# Altium schematic sheet M4_Sensors.SchDoc
size A3; SheetNumber: 4; SheetTotal: 5
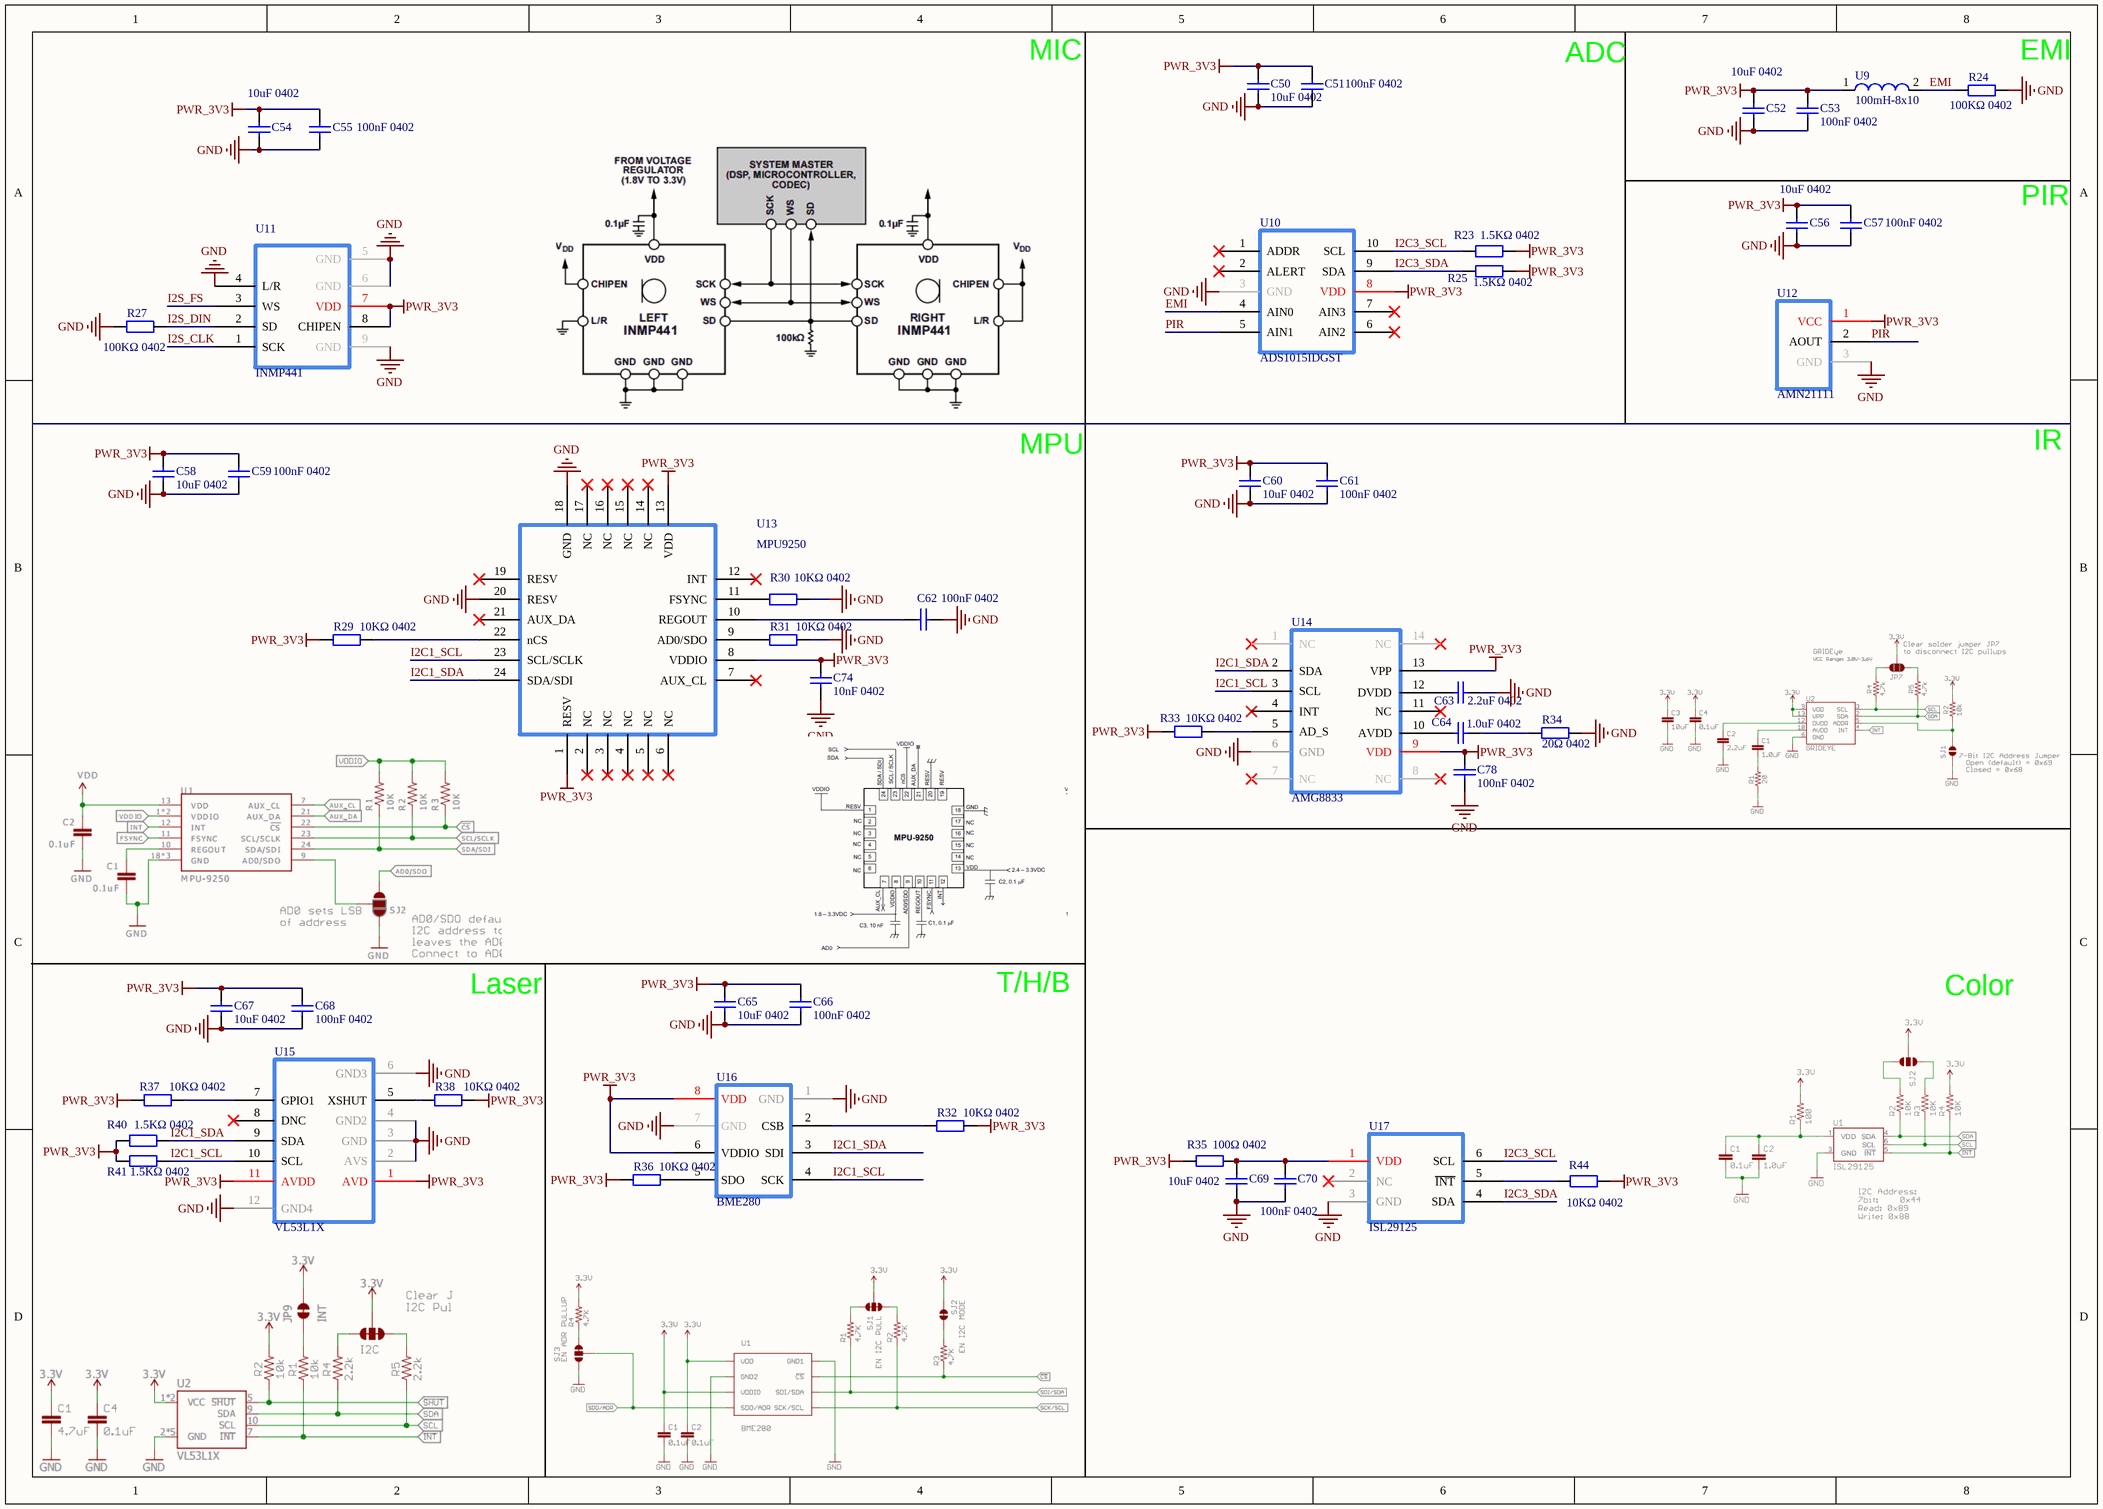
[diagram p0: M4_Sensors.SchDoc]

## Parts
C50  10uF 0402  [0402_C]
C51  100nF 0402  [0402_C]
C52  10uF 0402  [0402_C]
C53  100nF 0402  [0402_C]
C54  10uF 0402  [0402_C]
C55  100nF 0402  [0402_C]
C56  10uF 0402  [0402_C]
C57  100nF 0402  [0402_C]
C58  10uF 0402  [0402_C]
C59  100nF 0402  [0402_C]
C60  10uF 0402  [0402_C]
C61  100nF 0402  [0402_C]
C62  100nF 0402  [0402_C]
C63  2.2uF 0402  [0402_C]
C64  1.0uF 0402  [0402_C]
C65  10uF 0402  [0402_C]
C66  100nF 0402  [0402_C]
C67  10uF 0402  [0402_C]
C68  100nF 0402  [0402_C]
C69  10uF 0402  [0402_C]
C70  100nF 0402  [0402_C]
C74  10nF 0402  [0402_C]
C78  100nF 0402  [0402_C]
R23  1.5KΩ 0402  [0402_R]
R24  100KΩ 0402  [0402_R]
R25  1.5KΩ 0402  [0402_R]
R27  100KΩ 0402  [0402_R]
R29  10KΩ 0402  [0402_R]
R30  10KΩ 0402  [0402_R]
R31  10KΩ 0402  [0402_R]
R32  10KΩ 0402  [0402_R]
R33  10KΩ 0402  [0402_R]
R34  20Ω 0402  [0402_R]
R35  100Ω 0402  [0402_R]
R36  10KΩ 0402  [0402_R]
R37  10KΩ 0402  [0402_R]
R38  10KΩ 0402  [0402_R]
R40  1.5KΩ 0402  [0402_R]
R41  1.5KΩ 0402  [0402_R]
R44  10KΩ 0402  [0402_R]
U9  100mH-8x10  [100mH-8x10]
U10  ADS1015IDGST  [ADS1015]
U11  INMP441  [INMP441]
U12  AMN21111  [AMN21111]
U13  MPU9250  [MPU9250]
U14  AMG8833  [AMG8833]
U15  VL53L1X  [VL53L1X]
U16  BME280  [BME280]
U17  ISL29125  [ISL29125]

## Nets
GND: C50.1 C51.1 C52.1 C53.1 C54.1 C55.1 C56.1 C57.1 C58.2 C59.2 C60.2 C61.2 C62.2 C63.2 C65.2 C66.2 C67.1 C68.1 C69.2 C70.2 C74.1 C78.2 R24.2 R27.2 R30.2 R31.2 R34.2 U10.3(GND) U11.4(L/R) U11.5(GND) U11.6(GND) U11.9(GND) U12.3(GND) U13.18(GND) U13.20(RESV) U14.6(GND) U15.2(AVS) U15.3(GND) U15.4(GND2) U15.6(GND3) U15.12(GND4) U16.1(GND) U16.7(GND) U17.3(GND)
PWR_3V3: C50.2 C51.2 C52.2 C53.2 C54.2 C55.2 C56.2 C57.2 C58.1 C59.1 C60.1 C61.1 C65.1 C66.1 C67.2 C68.2 C74.2 C78.1 R23.2 R25.2 R29.1 R32.2 R33.1 R35.1 R36.1 R37.1 R38.2 R40.1 R41.1 R44.2 U9.1 U10.8(VDD) U11.7(VDD) U11.8(CHIPEN) U12.1(VCC) U13.1(RESV) U13.8(VDDIO) U13.13(VDD) U14.9(VDD) U14.13(VPP) U15.1(AVD) U15.11(AVDD) U16.6(VDDIO) U16.8(VDD)
EMI: R24.1 U9.2 U10.4(AIN0)
I2C1_SCL: R41.2 U13.23(SCL/SCLK) U14.3(SCL) U15.10(SCL) U16.4(SCK)
I2C1_SDA: R40.2 U13.24(SDA/SDI) U14.2(SDA) U15.9(SDA) U16.3(SDI)
I2C3_SCL: R23.1 U10.10(SCL) U17.6(SCL)
I2C3_SDA: R25.1 U10.9(SDA) U17.4(SDA)
I2S_CLK: U11.1(SCK)
I2S_DIN: R27.1 U11.2(SD)
I2S_FS: U11.3(WS)
PIR: U10.5(AIN1) U12.2(AOUT)
NetC62_1: C62.1 U13.10(REGOUT)
NetC63_1: C63.1 U14.12(DVDD)
NetC64_1: C64.1 U14.10(AVDD)
NetC64_2: C64.2 R34.1
NetC69_1: C69.1 C70.1 R35.2 U17.1(VDD)
NetR29_2: R29.2 U13.22(nCS)
NetR30_1: R30.1 U13.11(FSYNC)
NetR31_1: R31.1 U13.9(AD0/SDO)
NetR32_1: R32.1 U16.2(CSB)
NetR33_2: R33.2 U14.5(AD_S)
NetR36_2: R36.2 U16.5(SDO)
NetR37_2: R37.2 U15.7(GPIO1)
NetR38_1: R38.1 U15.5(XSHUT)
NetR44_1: R44.1 U17.5(~{INT})

Not connected (* = marked no-connect by the designer): U10 1(ADDR)* 2(ALERT)* 6(AIN2)* 7(AIN3)*; U13 2(NC)* 3(NC)* 4(NC)* 5(NC)* 6(NC)* 7(AUX_CL)* 12(INT)* 14(NC)* 15(NC)* 16(NC)* 17(NC)* 19(RESV)* 21(AUX_DA)*; U14 1(NC)* 4(INT)* 7(NC)* 8(NC)* 11(NC)* 14(NC)*; U15 8(DNC)*; U17 2(NC)*

## Notes on the sheet
- MIC
- ADC
- (near R24) EMI
- PIR
- IR
- MPU
- Laser
- T/H/B
- Color

## Library data of the parts
C50 C52 C54 C56 C58 C60 C65 C67 C69 = 0402 10uF (106) 20% 6.3V: 贴片电容; ComponentLink1Description: 供应商链接; ComponentLink1URL: http://www.szlcsc.com/product/details_16204.html; Package: 0402; Supplier: LC; SuppliersPartNumber: C15525
C51 C53 C55 C57 C59 C61 C62 C66 C68 C70 C78 = 0402 100nF (104) 10% 16V: 贴片电容; ComponentLink1Description: 供应商链接; ComponentLink1URL: http://www.szlcsc.com/product/details_1877.html; Package: 0402; Supplier: LC; SuppliersPartNumber: C1525
C63 = 0402 4.7uF (475) 20% 10V: 贴片电容; ComponentLink1Description: 供应商链接; ComponentLink1URL: http://www.szlcsc.com/product/details_24469.html; Package: 0402; Supplier: LC; SuppliersPartNumber: C23733
C64 = 0402 1.0uF (105) 10% 25V: 贴片电容; ComponentLink1Description: 供应商链接; ComponentLink1URL: http://www.szlcsc.com/product/details_53938.html; Package: 0402; Supplier: LC; SuppliersPartNumber: C52923
C74 = 0402 10nF (103) 10% 50V: 贴片电容; ComponentLink1Description: 供应商链接; ComponentLink1URL: http://www.szlcsc.com/product/details_15869.html; Package: 0402; Supplier: LC; SuppliersPartNumber: C15195
R23 R25 R40 R41 = 0402 1.5KΩ (1501) 1%: 贴片电阻; ComponentLink1Description: 供应商链接; ComponentLink1URL: http://www.szlcsc.com/product/details_26610.html; Package: 0402; Supplier: LC; SuppliersPartNumber: C25867
R24 R27 = 0402 100KΩ (1003) 1%: 贴片电阻; ComponentLink1Description: 供应商链接; ComponentLink1URL: http://www.szlcsc.com/product/details_26484.html; Package: 0402; Supplier: LC; SuppliersPartNumber: C25741
R29-R33 R36-R38 R44 = 0402 10KΩ (1002) 1%: 贴片电阻; ComponentLink1Description: 供应商链接; ComponentLink1URL: http://www.szlcsc.com/product/details_26487.html; Package: 0402; Supplier: LC; SuppliersPartNumber: C25744
R34 = 0402 22Ω (22R0) 1%: 贴片电阻; ComponentLink1Description: 供应商链接; ComponentLink1URL: http://www.szlcsc.com/product/details_25835.html; Package: 0402; Supplier: LC; SuppliersPartNumber: C25092
R35 = 0402 100Ω (1000) 1%: 贴片电阻; ComponentLink1Description: 供应商链接; ComponentLink1URL: http://www.szlcsc.com/product/details_25819.html; Package: 0402; Supplier: LC; SuppliersPartNumber: C25076
U9 = 100mH-8x10: Sensor 100mH
U10 = ADS1015IDGST: ADC 12Bit 4Channel; MF: Texas Instruments; Mouser-Purchase-URL: https://snapeda.com/shop?store=Mouser&id=425936; Price: None; Availability: Good; Package: VSSOP-10 Texas Instruments; DigiKey-Purchase-URL: https://snapeda.com/shop?store=DigiKey&id=425936; MP: ADS1015IDGST; Value: *; SnapEDA_Link: https://www.snapeda.com/parts/ADS1015IDGST/Texas%20Instruments/view-part/425936/?ref=snap; Texas_Instruments-Purchase-URL: https://snapeda.com/shop?store=Texas+Instruments&id=425936
U11 = INMP441: Sensor Microphone
U12 = AMN21111: Sensor PIR
U13 = MPU9250: Sensor MPU
U14 = AMG8833: Sensor IR
U15 = VL53L1X: Sensor Laser
U16 = BME280: Sensor T/H/B TOP View
U17 = ISL29125: Sensor Color